# EAGLE design MiP_ProMini_16MHz-Pack (EAGLE 7.5.0)
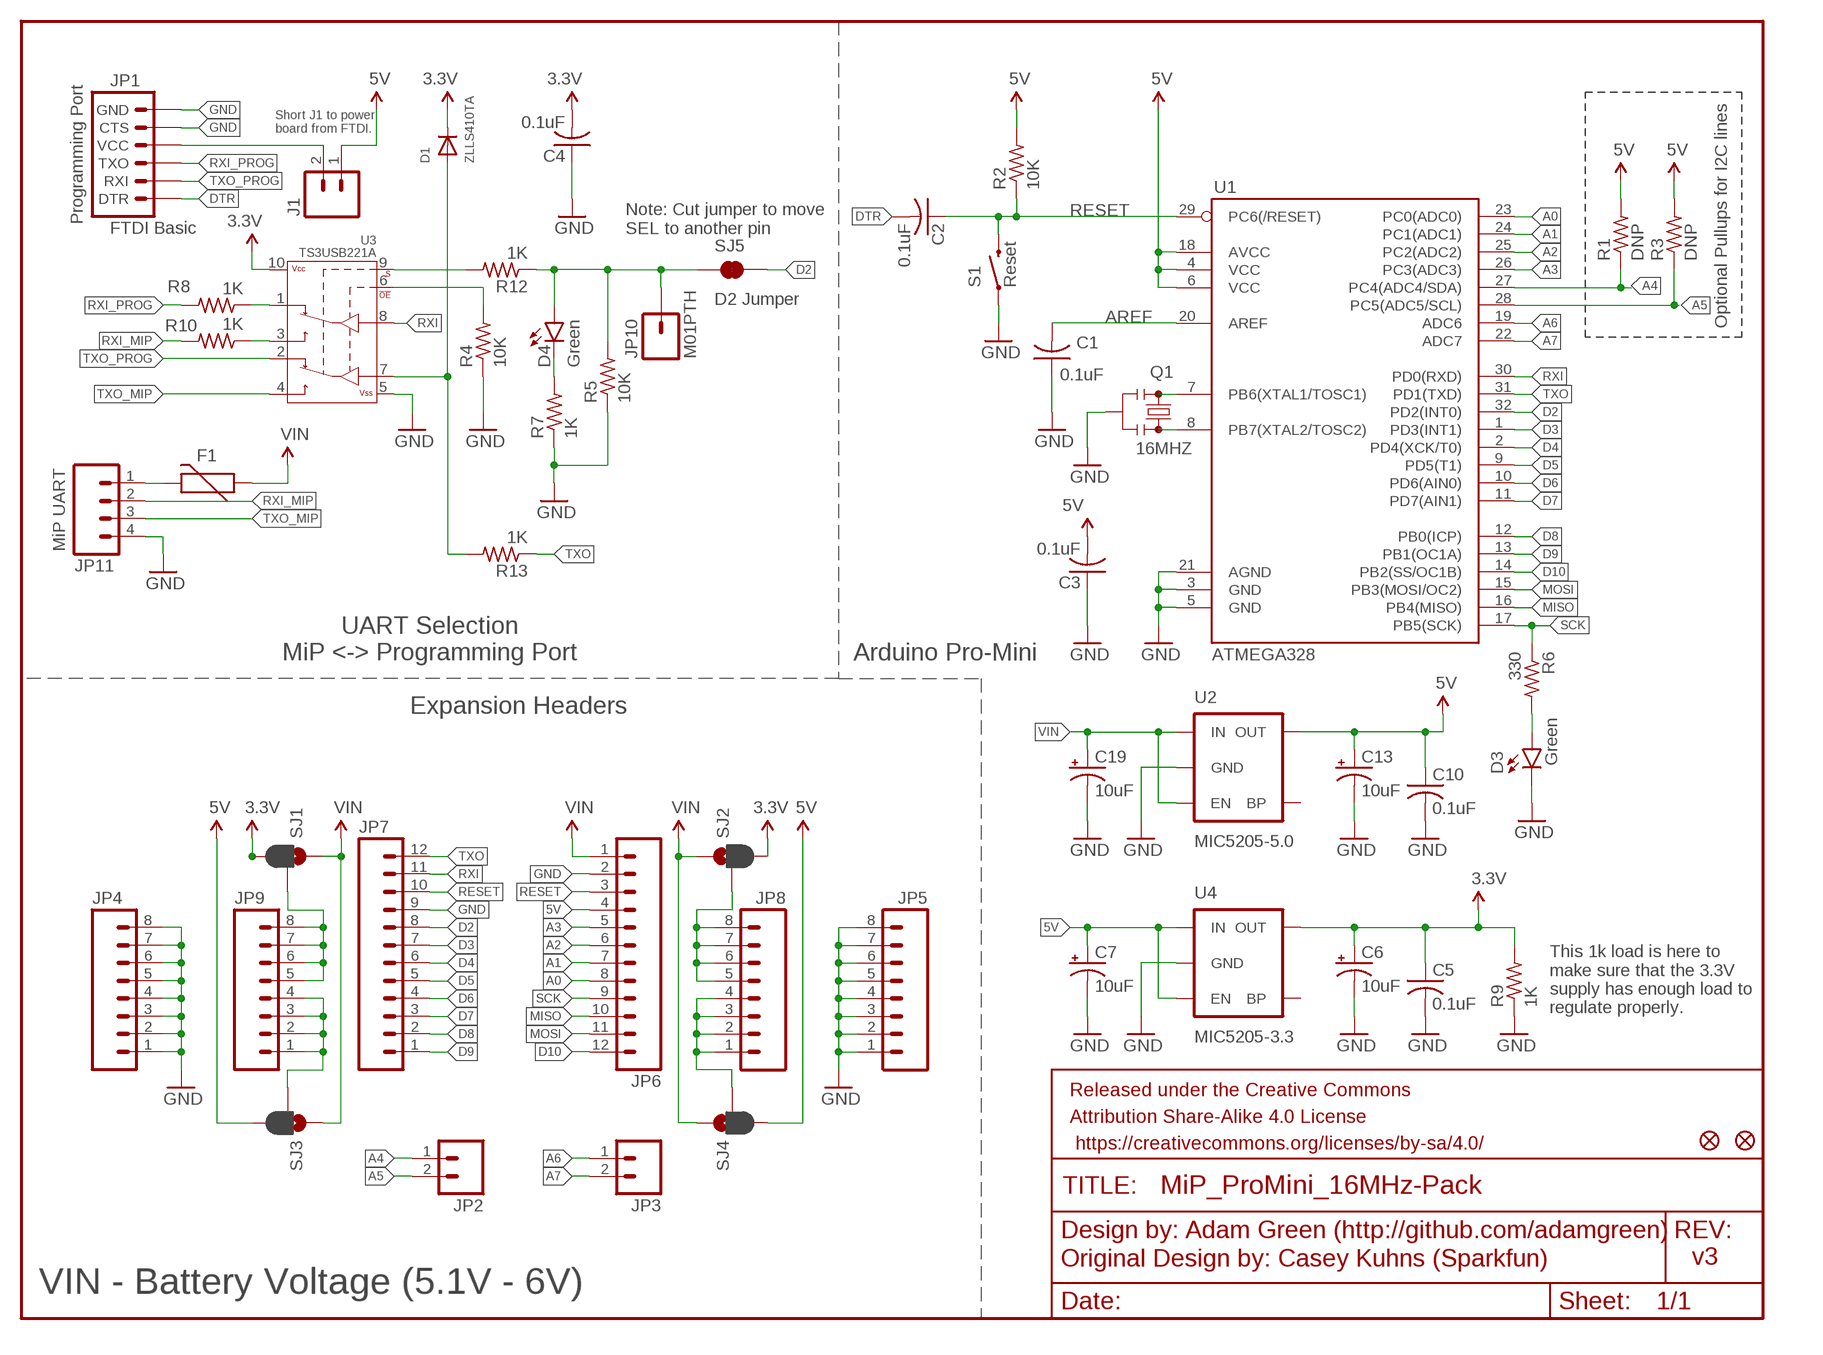
[diagram p0: schematic, sheet 1]

## Parts
C1  0.1uF  C-USC0805  [C0805]
C2  0.1uF  C-USC0805  [C0805]
C3  0.1uF  C-USC0805  [C0805]
C4  0.1uF  C-USC0805  [C0805]
C5  0.1uF  C-USC0805  [C0805]
C6  10uF  CAP_POL1206  [EIA3216]
C7  10uF  CAP_POL1206  [EIA3216]
C10  0.1uF  C-USC0805  [C0805]
C13  10uF  CAP_POL1206  [EIA3216]
C19  10uF  CAP_POL1206  [EIA3216]
D1  ZLLS410TA  DIODESOD-323F  [SOD-323F]
D3  Green  LED-GREEN0603  [LED-0603]
D4  Green  LED-GREEN0603  [LED-0603]
F1  PTCCUSTOM  [PTC-1206-CUSTOM]
FID1  FIDUCIAL1X2  [FIDUCIAL-1X2]
FID2  FIDUCIAL1X2  [FIDUCIAL-1X2]
FRAME1  FRAME-LETTER  [CREATIVE_COMMONS]
J1  M02PTH  [1X02]
JP1  FTDI Basic  ARDUINO_SERIAL_PROGRAMPTH  [1X06]
JP2  M02PTH  [1X02]
JP3  M02PTH  [1X02]
JP4  M081X08  [1X08]
JP5  M081X08  [1X08]
JP6  M12PTH  [1X12]
JP7  M12PTH  [1X12]
JP8  M081X08  [1X08]
JP9  M081X08  [1X08]
JP10  M01PTH  [1X01]
JP11  M04JST  [1X04-1.5MM_JST]
Q1  16MHZ  RESONATORMURATA_16MHZ  [RESONATOR-SMD-CUSTOM]
R1  DNP  R-US_R0805  [R0805]
R2  10K  R-US_R0805  [R0805]
R3  DNP  R-US_R0805  [R0805]
R4  10K  R-US_R0805  [R0805]
R5  10K  R-US_R0805  [R0805]
R6  330  R-US_R0805  [R0805]
R7  1K  R-US_R0805  [R0805]
R8  1K  R-US_R0805  [R0805]
R9  1K  R-US_R0805  [R0805]
R10  1K  R-US_R0805  [R0805]
R12  1K  R-US_R0805  [R0805]
R13  1K  R-US_R0805  [R0805]
S1  Reset  SWITCH-MOMENTARY-NOSMD  [TACTILE-SWITCH-SMD-CKN9112CT-ND]
SJ1  JUMPER-PAD-3-2OF3_NC_BY_PASTE  [PAD-JUMPER-3-2OF3_NC_BY_PASTE_YES_SILK_FULL_BOX]
SJ2  JUMPER-PAD-3-2OF3_NC_BY_PASTE  [PAD-JUMPER-3-2OF3_NC_BY_PASTE_YES_SILK_FULL_BOX]
SJ3  JUMPER-PAD-3-2OF3_NC_BY_PASTE  [PAD-JUMPER-3-2OF3_NC_BY_PASTE_YES_SILK_FULL_BOX]
SJ4  JUMPER-PAD-3-2OF3_NC_BY_PASTE  [PAD-JUMPER-3-2OF3_NC_BY_PASTE_YES_SILK_FULL_BOX]
SJ5  D2 Jumper  JUMPER-PAD-2-NC_BY_TRACE  [PAD-JUMPER-2-NC_BY_TRACE_YES_SILK]
U1  ATMEGA328  ATMEGA328_SMT  [TQFP32-08]
U2  MIC5205-5.0  MIC52053.3V  [SOT23-5]
U3  TS3USB221A  TS3USB221ACUSTOM  [QFN-10-RSE-CUSTOM]
U4  MIC5205-3.3  MIC52053.3V  [SOT23-5]

## Nets
3.3V: C4.2 C5.1 C6.A(+) D1.C R9.2 SJ1.3 SJ2.3 U3.10(VCC) U4.5(OUT)
5V: C3.2 C7.A(+) C10.1 C13.A(+) J1.1 JP6.4 R1.2 R2.2 R3.2 SJ3.3 SJ4.3 U1.4(VCC) U1.6(VCC) U1.18(AVCC) U2.5(OUT) U4.1(IN) U4.3(EN)
A0: JP6.8 U1.23(PC0(ADC0))
A1: JP6.7 U1.24(PC1(ADC1))
A2: JP6.6 U1.25(PC2(ADC2))
A3: JP6.5 U1.26(PC3(ADC3))
A4: JP2.1 R1.1 U1.27(PC4(ADC4/SDA))
A5: JP2.2 R3.1 U1.28(PC5(ADC5/SCL))
A6: JP3.1 U1.19(ADC6)
A7: JP3.2 U1.22(ADC7)
AREF: C1.2 U1.20(AREF)
D2: JP7.8 SJ5.2 U1.32(PD2(INT0))
D3: JP7.7 U1.1(PD3(INT1))
D4: JP7.6 U1.2(PD4(XCK/T0))
D5: JP7.5 U1.9(PD5(T1))
D6: JP7.4 U1.10(PD6(AIN0))
D7: JP7.3 U1.11(PD7(AIN1))
D8: JP7.2 U1.12(PB0(ICP))
D9: JP7.1 U1.13(PB1(OC1A))
D10: JP6.12 U1.14(PB2(SS/OC1B))
DTR: C2.2 JP1.1(DTR)
GND: C1.1 C3.1 C4.1 C5.2 C6.C(-) C7.C(-) C10.2 C13.C(-) C19.C(-) D3.C JP1.5(CTS) JP1.6(GND) JP4.1 JP4.2 JP4.3 JP4.4 JP4.5 JP4.6 JP4.7 JP4.8 JP5.1 JP5.2 JP5.3 JP5.4 JP5.5 JP5.6 JP5.7 JP5.8 JP6.2 JP7.9 JP11.4 Q1.2 R4.1 R5.1 R7.1 R9.1 S1.1 U1.3(GND) U1.5(GND) U1.21(AGND) U2.2(GND) U3.5(VSS) U4.2(GND)
MISO: JP6.10 U1.16(PB4(MISO))
MOSI: JP6.11 U1.15(PB3(MOSI/OC2))
N$1: Q1.3 U1.8(PB7(XTAL2/TOSC2))
N$2: JP9.5 JP9.6 JP9.7 JP9.8 SJ1.2
N$3: JP9.1 JP9.2 JP9.3 JP9.4 SJ3.2
N$4: Q1.1 U1.7(PB6(XTAL1/TOSC1))
N$5: JP8.5 JP8.6 JP8.7 JP8.8 SJ2.2
N$6: JP8.1 JP8.2 JP8.3 JP8.4 SJ4.2
N$7: D3.A R6.2
N$8: D4.C R7.2
N$9: R10.1 U3.3(2D+)
N$11: R8.1 U3.1(1D+)
N$12: R4.2 U3.6(!OE)
N$15: J1.2 JP1.4(VCC)
N$16: R12.2 U3.9(S)
N$17: F1.2 JP11.1
N$18: D1.A R13.2 U3.7(D-)
RESET: C2.1 JP6.3 JP7.10 R2.1 S1.3 U1.29(PC6(/RESET))
RXI: JP7.11 U1.30(PD0(RXD)) U3.8(D+)
RXI_MIP: JP11.2 R10.2
RXI_PROG: JP1.3(TXO) R8.2
SCK: JP6.9 R6.1 U1.17(PB5(SCK))
SELECT: D4.A JP10.1 R5.2 R12.1 SJ5.1
TXO: JP7.12 R13.1 U1.31(PD1(TXD))
TXO_MIP: JP11.3 U3.4(2D-)
TXO_PROG: JP1.2(RXI) U3.2(1D-)
VIN: C19.A(+) F1.1 JP6.1 SJ1.1 SJ2.1 SJ3.1 SJ4.1 U2.1(IN) U2.3(EN)
Unconnected: U2.4(BP) U4.4(BP)

## Notes on the sheet
- Short J1 to power
  board from FTDI.
- Programming Port
- Note: Cut jumper to move
  SEL to another pin
- Optional Pullups for I2C lines
- MiP UART
- UART Selection
  MiP <-> Programming Port
- Arduino Pro-Mini
- Expansion Headers
- This 1k load is here to 
  make sure that the 3.3V 
  supply has enough load to 
  regulate properly.
- Adam Green (http://github.com/adamgreen)
- Original Design by: Casey Kuhns (Sparkfun) | v3
- VIN - Battery Voltage (5.1V - 6V)

## Library data of the parts
C1-C5 C10 = rcl:C-US: CAPACITOR, American symbol
C6 C7 C13 C19 = SparkFun:CAP_POL: Capacitor Polarized These are standard SMD and PTH capacitors. Normally 10uF, 47uF, and 100uF in electrolytic and tantalum varieties. Always verify the external diameter of the through hole cap, it varies with capacity, voltage, and manufacturer. The EIA devices should be standard.
D1 = adafruit:DIODE: Diode SMADIODE - SMA Surface Mount Package 20V 1A Schottky Diode Digikey: 641-1014-6-ND DO-1N4148 - Through Hole Small Current Diode SOD-123 20V 1 A (.5mV Vf) Schottky Diode - Digikey: MBRX120TPMSCT-ND SOD-323 10V 570mA (.38mV Vf, 3ns) Schottky Diode - Digikey: ZLLS410CT-ND SOD-523 30V 30mA Schottky Diode (RB751S-40TE61) - Digikey: RB751S-40TE61CT-ND SOT23-R/W - SOT23 Package (R = Solder Paste/Reflow Ovens, W = Hand-Soldering) BAT54Film 40V 300mA - Digikey: 497-7162-1-ND
D3 D4 = SparkFun-LED:LED-GREEN: Various green LEDs Green LEDs used in SFE Production 0603- DIO-00821 LARGE- DIO-00862 LILYPAD- DIO-09910; PROD_ID: DIO-00821; VALUE: GREEN
F1 = adam_custom:PTC: Resettable Fuse PTC Resettable Fuse. Spark Fun Electronics SKU : COM-08357
FID1 FID2 = SparkFun-Aesthetics:FIDUCIAL: Fiducial Alignment Points Various fiducial points for machine vision alignment.
FRAME1 = SparkFun-Aesthetics:FRAME-LETTER: Schematic Frame Standard 8.5x11 US Letter frame
J1 = SparkFun-Connectors:M02: Standard 2-pin 0.1" header. Use with - straight break away headers ( PRT-00116) - right angle break away headers (PRT-00553) - swiss pins (PRT-00743) - machine pins (PRT-00117) - female headers (PRT-00115) Molex polarized connector foot print use with: PRT-08233 with associated crimp pins and housings. 2.54_SCREWTERM for use with PRT-10571. 3.5mm Screw Terminal footprints for PRT-08084 5mm Screw Terminal footprints for use with PRT-08432
JP1 = SparkFun:ARDUINO_SERIAL_PROGRAM
JP2 JP3 = SparkFun:M02: Header 2 Standard 2-pin 0.1" header. Use with straight break away headers (SKU : PRT-00116), right angle break away headers (PRT-00553), swiss pins (PRT-00743), machine pins (PRT-00117), and female headers (PRT-00115). Molex polarized connector foot print use with SKU : PRT-08233 with associated crimp pins and housings.
JP4 JP5 JP8 JP9 = SparkFun-Connectors:M08: Header 8 Standard 8-pin 0.1" header. Use with straight break away headers (SKU : PRT-00116), right angle break away headers (PRT-00553), swiss pins (PRT-00743), machine pins (PRT-00117), and female headers (PRT-00115).
JP6 JP7 = SparkFun:M12: Header 12 Standard 12-pin 0.1" header. Use with straight break away headers (SKU : PRT-00116), right angle break away headers (PRT-00553), swiss pins (PRT-00743), machine pins (PRT-00117), and female headers (PRT-00115).
JP10 = SparkFun-Connectors:M01: Header 1 Standard 1-pin 0.1" header. Use with straight break away headers (SKU : PRT-00116), right angle break away headers (PRT-00553), swiss pins (PRT-00743), machine pins (PRT-00117), and female headers (PRT-00115).
JP11 = SparkFun-Connectors:M04: Header 4 Standard 4-pin 0.1" header. Use with straight break away headers (SKU : PRT-00116), right angle break away headers (PRT-00553), swiss pins (PRT-00743), machine pins (PRT-00117), and female headers (PRT-00115). Molex polarized connector foot print use with SKU : PRT-08231 with associated crimp pins and housings. 1MM SMD Version SKU: PRT-10208
Q1 = adam_custom:RESONATOR: Resonator Small SMD resonator. Used, eg, on the Arduino Pro/ Pro Mini boards. 8MHz- XTAL-08895 16MHz- XTAL-08900
R1-R10 R12 R13 = rcl:R-US_: RESISTOR, American symbol
S1 = adam_custom:SWITCH-MOMENTARY-NO: Various NO switches- pushbuttons, reed, etc; PROD_ID: SWCH-08247
SJ1-SJ4 = SparkFun-Passives:JUMPER-PAD-3-2OF3_NC_BY_PASTE
SJ5 = SparkFun-Passives:JUMPER-PAD-2-NC_BY_TRACE
U1 = SparkFun-DigitalIC:ATMEGA328_SMT: 32-Pin Atmega328 part Commonly used on Arduino compatible boards Available in QFP and QFN packages TQFP is IC-09069 QFN is non-stock; PROD_ID: IC-09069; VALUE: ATMEGA328P
U2 U4 = SparkFun-PowerIC:MIC5205: MIC5205 150mA vreg 3.3V - VREG-00822 5V - VREG-00823; PROD_ID: VREG-00822
U3 = adam_custom:TS3USB221A: DPDT Analog Mux Vcc 2.5 to 3.3V Passes up to 5.5V at 3.3V supply 900MHz BW, 6Ω switch resistance

## Net classes
0 default: width 0.152 mm
1 vcc: width 0.254 mm

## Board
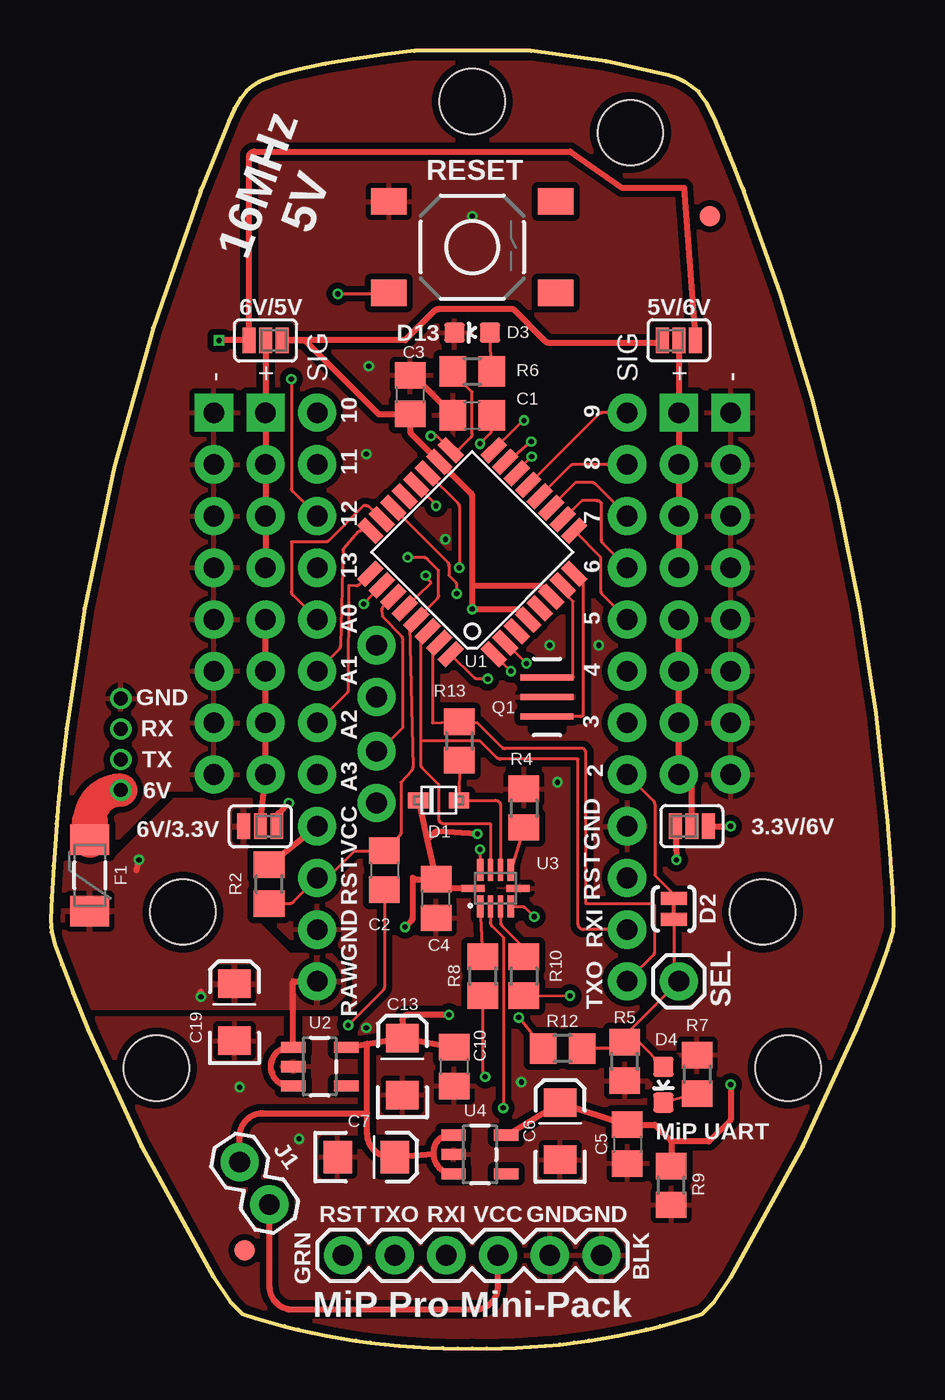
[diagram p1: board, top side]
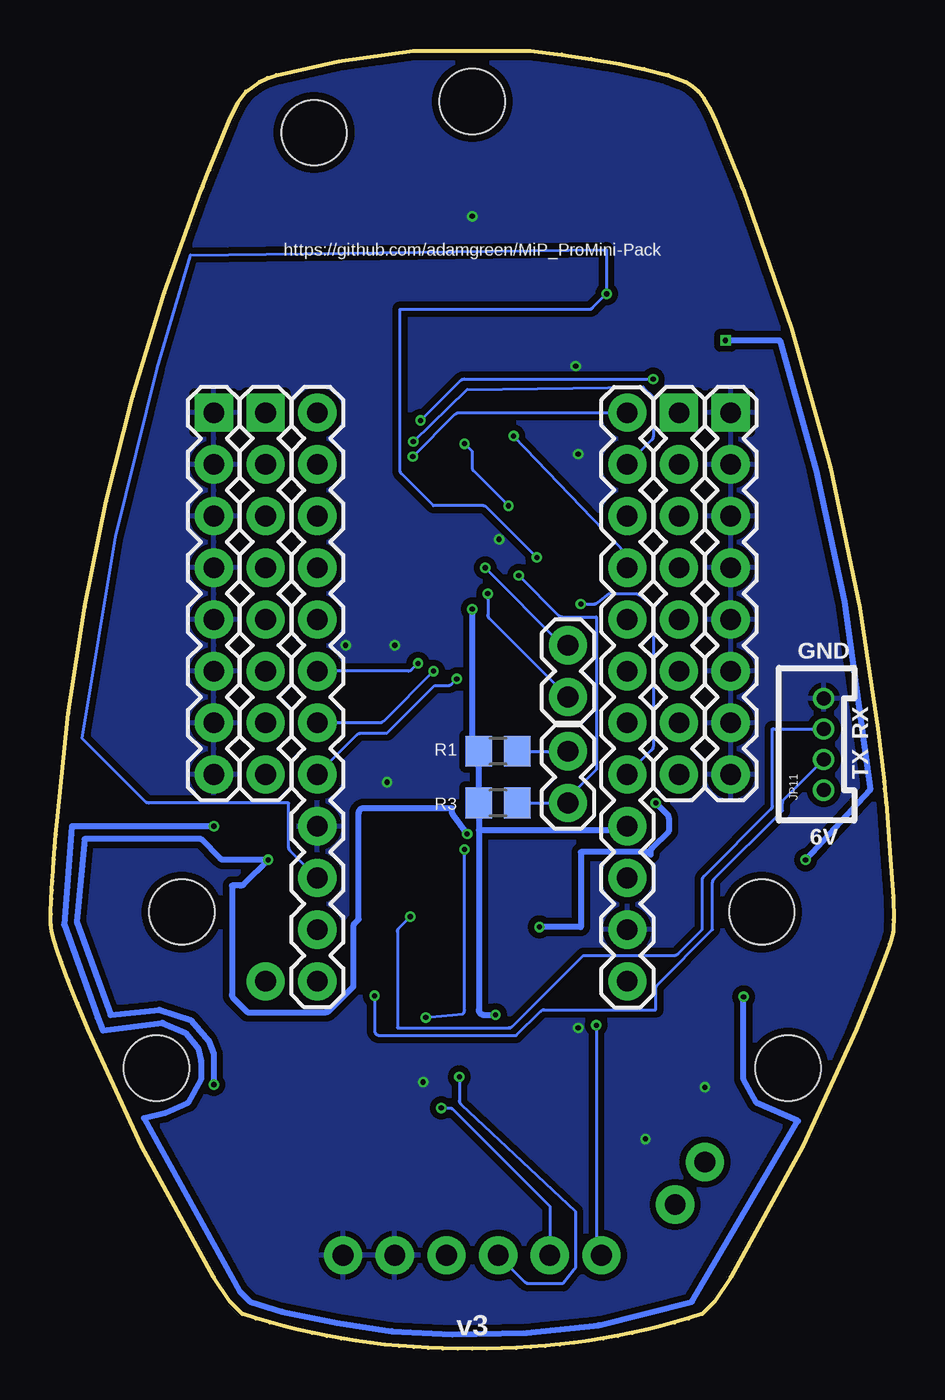
[diagram p2: board, bottom side, seen from below]

Size 41.42 x 63.77 mm. Coordinates in mm from the lower left corner, seen from the top.
Outline: 16.32,63.59 14.86,63.37 13.5,63.13 12.25,62.87 11.09,62.58 10.24,62.25 9.89,62.03 9.6,61.78 9.32,61.43 9.03,60.94 8.74,60.3 7.46,57.12 7.46,57.1 7.45,57.09 7.44,57.07 7.44,57.06 7.43,57.04 7.42,57.03 7.42,57.01 7.41,57 7.4,56.98 7.4,56.97 7.39,56.96 7.38,56.94 7.37,56.93 7.36,56.91 7.36,56.9 7.35,56.88 5.02,50.15 3.12,43.32 1.66,36.38 0.77,30.47 0.47,27.85 0.44,27.51 0.4,27.17 0.37,26.82 0.31,26.14 0.28,25.79 0.13,23.74 0.03,22.17 0,21.08 0.01,20.71 0.03,20.47 0.2,19.87 0.55,18.87 1.09,17.47 1.83,15.67 4.46,9.93 8.01,3.51 8.82,2.29 9.4,1.71 10.08,1.49 10.77,1.29 11.47,1.1 12.16,0.93 12.86,0.77 13.57,0.63 14.27,0.5 14.98,0.39 15.69,0.29 16.41,0.21 17.12,0.14 17.84,0.08 18.56,0.04 19.27,0.02 19.99,0 20.71,0.01 21.43,0 22.15,0.01 22.86,0.04 23.58,0.08 24.3,0.13 25.01,0.2 25.72,0.29 26.44,0.39 27.15,0.5 27.85,0.63 28.56,0.77 29.26,0.93 29.95,1.1 30.65,1.29 31.34,1.49 32.02,1.71 32.6,2.29 33.41,3.51 36.96,9.93 39.59,15.67 40.12,16.97 40.56,18.08 40.91,19 41.11,19.57 41.26,20.03 41.39,20.5 41.42,20.84 41.42,21.36 41.4,22.11 41.37,22.52 41.35,22.98 41.31,23.48 41.27,24.03 41.23,24.62 41.18,25.26 41.12,25.94 40.56,31.21 39.75,36.45 38.69,41.65 37.39,46.79 35.85,51.87 34.07,56.88 34.06,56.9 34.05,56.91 34.05,56.93 34.04,56.94 34.03,56.96 34.02,56.97 34.02,56.98 34.01,57 34,57.01 33.99,57.03 33.99,57.04 33.98,57.06 33.98,57.07 33.97,57.09 33.96,57.1 33.96,57.12 33.64,57.92 33.33,58.72 33.01,59.51 32.68,60.3 32.24,61.2 31.83,61.77 31.18,62.24 30.78,62.43 30.33,62.58 27.28,63.25 23.6,63.77 17.87,63.77 16.32,63.59
Copper layers (1*16): Top 0.035559375mm / dielectric 1.6mm / Bottom 0.035559375mm
Design rules "oshpark-2layer": minimum track width 6mil, minimum drill 10mil, track to track 6mil, track to pad 6mil, pad to pad 6mil, via to via 6mil, smd to smd 6mil, copper to edge 15mil, drill to drill 6mil, minimum pad ring 5mil, minimum via ring 5mil, stop-mask expansion 2.5mil, vias tented up to drill 0mil, thermal gap 10mil
Holes 3.2 mm at 20.71,61.28 28.48,59.76 34.98,21.45 5.19,13.78 36.23,13.78 6.49,21.45

### Footprints (pad centres in the part's own frame; a part is rotated, then mirrored left to right if it is on the bottom)
C0805 = smd 1.3 x 1.5: 1 -0.95,0; 2 0.95,0
EIA3216 = smd 1.4 x 1.6: A 1.4,0; C -1.4,0
SOD-323F = smd 1 x 0.8: A -1,0; C 1,0
LED-0603 = smd 1 x 1: A 0,-0.877; C 0,0.877
PTC-1206-CUSTOM = smd 1.5 x 1.9: 1 -1.75,0; 2 1.75,0
FIDUCIAL-1X2 = smd 1 x 1: 1 0,0
1X02 = drill 1.016 pad 1.88: 1 0,0; 2 2.54,0
1X06 = drill 1.016 pad 1.88: 1 0,0; 2 2.54,0; 3 5.08,0; 4 7.62,0; 5 10.16,0; 6 12.7,0
1X08 = drill 1.016 pad 1.88 square: 1 0,0 | drill 1.016 pad 1.88: 2 2.54,0; 3 5.08,0; 4 7.62,0; 5 10.16,0; 6 12.7,0; 7 15.24,0; 8 17.78,0
1X12 = drill 1.016 pad 1.88: 1 0,0; 2 2.54,0; 3 5.08,0; 4 7.62,0; 5 10.16,0; 6 12.7,0; 7 15.24,0; 8 17.78,0; 9 20.32,0; 10 22.86,0; 11 25.4,0; 12 27.94,0
1X01 = drill 1.016 pad 1.88: 1 0,0
1X04-1.5MM_JST = drill 0.7: 1 0,0; 2 1.5,0; 3 3,0; 4 4.5,0
RESONATOR-SMD-CUSTOM = smd 0.3 x 2.6: 1 -0.95,0; 2 0,0; 3 0.95,0
R0805 = smd 1.3 x 1.5: 1 -0.95,0; 2 0.95,0
TACTILE-SWITCH-SMD-CKN9112CT-ND = smd 1.75 x 1.3: 1 -4.1,2.25; 2 4.1,2.25; 3 -4.1,-2.25; 4 4.1,-2.25
PAD-JUMPER-3-2OF3_NC_BY_PASTE_YES_SILK_FULL_BOX = smd 0.635 x 1.27: 1 -0.813,0; 2 0,0; 3 0.813,0
PAD-JUMPER-2-NC_BY_TRACE_YES_SILK = smd 0.635 x 1.27: 1 -0.508,0; 2 0.508,0
TQFP32-08 = smd 1.27 x 0.559: 1 -4.293,2.8; 2 -4.293,2; 3 -4.293,1.2; 4 -4.293,0.4; 5 -4.293,-0.4; 6 -4.293,-1.2; 7 -4.293,-2; 8 -4.293,-2.8; 17 4.293,-2.8; 18 4.293,-2; 19 4.293,-1.2; 20 4.293,-0.4; 21 4.293,0.4; 22 4.293,1.2; 23 4.293,2; 24 4.293,2.8 | smd 0.559 x 1.27: 9 -2.8,-4.293; 10 -2,-4.293; 11 -1.2,-4.293; 12 -0.4,-4.293; 13 0.4,-4.293; 14 1.2,-4.293; 15 2,-4.293; 16 2.8,-4.293; 25 2.8,4.293; 26 2,4.293; 27 1.2,4.293; 28 0.4,4.293; 29 -0.4,4.293; 30 -1.2,4.293; 31 -2,4.293; 32 -2.8,4.293
SOT23-5 = smd 0.55 x 1.2: 1 -0.95,-1.3; 2 0,-1.3; 3 0.95,-1.3; 4 0.95,1.3; 5 -0.95,1.3
QFN-10-RSE-CUSTOM = smd 1.08 x 0.3: 1 -0.9,0.75; 4 -0.9,-0.75; 6 0.9,-0.75; 9 0.9,0.75 | smd 1.08 x 0.25: 2 -0.9,0.25; 3 -0.9,-0.25; 7 0.9,-0.25; 8 0.9,0.25 | smd 0.35 x 1.13: 5 0,-1.1; 10 0,1.1

### Placement (x,y rotation side)
C1  20.71,45.86 0 top
C2  16.39,23.51 270 top
C3  17.66,46.88 270 top
C4  18.93,22.11 90 top
C5  28.33,10.05 270 top
C6  25.03,10.68 90 top
C7  15.5,9.41 0 top
C10  19.82,13.86 270 top
C13  17.28,13.86 90 top
C19  9.02,16.53 90 top
D1  19.06,26.94 180 top
D3  20.71,49.93 90 top
D4  30.11,12.97 180 top
F1  1.91,23.26 90 top
FID1  9.53,4.84 0 top
FID2  32.39,55.64 0 top
FRAME1  4.43,-9.76 0 top  (outside the outline)
J1  9.28,9.16 305 top
JP1  14.36,4.59 0 top
JP2  16.01,29.35 270 bottom
JP3  16.01,34.56 270 bottom
JP4  33.41,45.99 270 bottom
JP5  8.01,45.99 270 bottom
JP6  13.09,18.05 90 bottom
JP7  28.33,45.99 270 bottom
JP8  30.87,45.99 270 bottom
JP9  10.55,45.99 270 bottom
JP10  30.87,18.05 0 top
JP11  3.44,27.45 90 bottom
Q1  24.39,32.02 270 top
R1  19.44,29.35 180 bottom
R2  10.73,22.83 90 top
R3  19.44,26.81 180 bottom
R4  23.25,26.56 270 top
R5  28.2,14.11 90 top
R6  20.71,48.02 0 top
R7  31.76,13.48 270 top
R8  21.22,18.3 270 top
R9  30.49,8.02 90 top
R10  23.25,18.3 270 top
R12  25.15,14.75 180 top
R13  20.07,29.86 270 top
S1  20.71,54.12 0 top
SJ1  10.29,25.67 0 top
SJ2  31.5,25.67 180 top
SJ3  10.55,49.55 0 top
SJ4  30.87,49.55 180 top
SJ5  30.62,21.61 90 top
U1  20.71,39.13 135 top
U2  13.22,13.86 270 top
U3  21.85,22.62 90 top
U4  21.09,9.54 270 top

### Tracks (layer width: path | path; a pad name or v marks a point on that pad's centre or on a via)
3.3V  (via drill 0.25 pad 0.51)
  Top 0.305: SJ2.3 v30.74,24.02 | v33.41,12.97 33.41,11.25 32.33,10.18 30.49,10.18 | U3.10 19.48,22.62 arc-45 19.3,22.7 C4.2 | D1.C 18.5,24.99 | 18.5,24.99 C4.2 | SJ1.3 11.11,26.12 arc-45 11.18,26.3 v11.69,26.81 | v17.41,20.72 17.71,21.02 arc45 17.79,21.2 17.79,23.13 arc45 17.95,23.06 C4.2 | v20.96,25.29 19.02,25.42 arc45 18.84,25.34 18.5,24.99 | U4.5 C6.A C5.1 29.67,11 30.49,10.18 | 30.49,10.18 R9.2
  Bottom 0.305: v33.41,12.97 33.41,14.49 33.66,15.13 34.55,16.14 36.08,16.65 38.49,16.4 40.14,20.97 39.76,25.04 34.04,25.04 33.1,24.09 arc-45 32.92,24.02 v30.74,24.02 31.94,22.82 arc45 32.12,22.75 32.52,22.75 32.52,17.39 arc-45 32.45,17.21 31.76,16.53 27.93,16.53 arc-45 27.75,16.6 26.55,17.8 26.55,20.74 arc45 26.48,20.92 26.3,21.1 26.3,26.3 arc90 26.04,26.56 21.73,26.56 21.73,26.41 arc-45 21.65,26.23 v20.96,25.29 | v11.69,26.81 11.13,26.25 arc45 11.06,26.07 11.06,25.42 11.87,24.6 arc-45 11.95,24.42 11.95,24.27 12,24.33 arc-45 12.18,24.4 15.37,24.4 15.37,20.72 v17.41,20.72
5V  (via drill 0.25 pad 0.51)
  Top 0.305: U2.5 15.55,14.98 | 15.55,14.98 C13.A | C13.A C10.1 | 15.55,11.57 15.55,10.56 arc90 16.69,9.41 C7.A 18.8,9.58 | 15.55,11.57 15.55,14.98 | U4.1 19.63,10.49 arc90 18.8,9.67 18.8,9.58 | 18.8,9.58 arc90 U4.3 | J1.1 9.28,10.43 arc-90 10.42,11.57 15.55,11.57 | v19.57,16.4 17.53,16.4 arc90 17.28,16.14 C13.A | R2.2 JP6.4 | U1.4 23.01,36.26 arc45 22.83,36.34 v20.71,36.34 20.71,37.48 | U1.6 24.13,37.41 arc45 23.95,37.48 20.71,37.48 | 20.71,37.48 20.71,41.86 arc45 20.64,42.04 U1.18 17.73,44.93 arc-45 17.66,45.11 C3.2 arc-45 17.62,45.91 16.11,45.91 12.55,49.47 arc45 12.37,49.55 SJ3.3 17.41,49.55 18.86,51 arc-45 19.04,51.07 22.74,51.07 24.32,49.49 arc45 24.5,49.42 30.11,49.42 arc-45 SJ4.3 SJ4.3 arc45 30.03,49.48
  Bottom 0.305: 20.39,25.47 R3.2 R1.2 20.46,29.35 arc90 20.71,29.61 v20.71,36.34 | 20.39,25.47 20.39,16.65 arc-90 20.14,16.4 v19.57,16.4 | JP6.4 arc90 13.29,25.47 20.39,25.47
A0
  Top 0.152: U1.23 15.67,41.34 arc45 15.49,41.42 15.37,41.42 13.67,39.71 arc-45 13.49,39.64 11.82,39.64 11.82,37.2 arc45 11.89,37.03 JP6.8
A1
  Top 0.152: U1.24 15.27,40.19 arc45 15.09,40.11 14.36,39.26 14.23,34.54 arc-45 14.16,34.36 JP6.7
A2
  Top 0.152: U1.25 15.17,37.55 arc-45 14.99,37.48 14.64,37.51 14.61,32.38 arc-45 14.54,32.2 JP6.6
A3  (via drill 0.25 pad 0.51)
  Top 0.152: U1.26 v15.37,36.59
  Bottom 0.152: v15.37,36.59 14.72,36.59 arc-45 14.54,36.67 13.98,37.1 12.69,37.1 arc45 12.51,37.03 11.82,36.47 11.82,29.59 arc45 11.89,29.41 JP6.5
A4
  Top 0.152: U1.27 16.34,36.46 arc45 16.26,36.28 16.29,35.98 17.23,35.02 arc-45 17.28,34.71 17.28,30.5 16.21,29.43 arc-45 16.03,29.35 JP2.1
  Bottom 0.152: R1.1 JP2.1
A5  (via drill 0.25 pad 0.51)
  Top 0.152: U1.28 18.68,37.61 v18.42,37.99
  Bottom 0.152: R3.1 JP2.2 16.01,26.96 arc45 15.94,27.14 14.61,28.46 14.61,35.96 16.29,35.96 arc45 16.46,36.03 v18.42,37.99
A6  (via drill 0.25 pad 0.51)
  Top 0.152: U1.19 20,41.54 arc-45 20.07,41.36 v20.07,38.37
  Bottom 0.152: v20.07,38.37 16.34,34.63 arc-45 16.16,34.56 JP3.1
A7  (via drill 0.25 pad 0.51)
  Top 0.152: U1.22 19.49,38.65 arc-45 19.57,38.47 19.57,37.99 19.87,37.68 arc-45 19.95,37.5 v19.95,37.1
  Bottom 0.152: v19.95,37.1 19.95,36.06 arc-45 19.87,35.88 JP3.2
AREF  (via drill 0.25 pad 0.51)
  Top 0.152: U1.20 18.89,41.52 arc-45 v18.93,41.42 | v21.09,44.47 21.59,44.96 arc45 21.66,45.14 C1.2
  Bottom 0.152: v18.93,41.42 20.64,43.12 arc45 20.71,43.3 20.71,44.09 v21.09,44.47
D2  (via drill 0.25 pad 0.51)
  Top 0.152: v21.47,32.91 20.97,32.91 arc-45 20.79,32.98 U1.32 | JP7.8 29.6,26.94 arc-45 29.68,26.76 29.68,23.26 30.54,22.39 arc-45 30.62,22.21 SJ5.2
  Bottom 0.152: JP7.8 26.37,30.17 arc45 26.19,30.24 24.9,30.24 22.56,32.58 21.91,32.58 arc-45 21.73,32.66 v21.47,32.91
D3  (via drill 0.25 pad 0.51)
  Top 0.152: U1.1 v22.61,33.29
  Bottom 0.152: v22.61,33.29 25.08,30.82 arc45 25.26,30.75 JP7.7
D4  (via drill 0.25 pad 0.51)
  Top 0.152: U1.2 arc-45 22.39,34.66 v23.38,33.67
  Bottom 0.152: v23.38,33.67 23.68,33.36 arc45 23.86,33.29 JP7.6
D5
  Top 0.152: JP7.5 27.11,37.05 arc-45 27.03,37.23 27.03,38.88 U1.9 | U1.9 arc-45 U1.9
D6
  Top 0.152: JP7.4 27.13,39.57 arc-45 27.06,39.74 27.06,41.55 27.01,41.6 arc45 26.83,41.67 26.09,41.67 25.19,40.77 arc-45 U1.10
D7
  Top 0.152: JP7.3 26.75,42.49 arc45 26.57,42.56 25.79,42.56 24.62,41.4 arc45 U1.11
D8
  Top 0.152: JP7.2 25.7,43.45 arc45 25.52,43.38 U1.12
D9
  Top 0.152: JP7.1 27.11,45.99 arc45 26.93,45.92 U1.13
D10  (via drill 0.25 pad 0.51)
  Top 0.152: U1.14 arc-45 22.95,43.15 v23.63,43.83
  Bottom 0.152: v23.63,43.83 21.55,45.92 arc45 21.37,45.99 JP6.12
DTR  (via drill 0.25 pad 0.51)
  Top 0.152: C2.2 16.39,17.77 arc-45 16.32,17.59 v14.61,15.89
  Bottom 0.152: v14.61,15.89 14.61,4.95 arc-45 14.54,4.77 JP1.1
GND  (via drill 0.25 pad 0.51)
  Top 0.305: C3.1 17.69,47.83 arc-45 17.87,47.76 C1.1
  other vias: 20.71,55.64 15.63,48.28 24.52,34.56 12.2,10.3 9.28,12.84 23.12,13.1 15.5,43.96 19.39,39.77 26.93,34.56 15.5,15.76 24.9,27.83
  pour Bottom (isolate 0.305): 41.41,63.77 41.41,-0.23 -0.59,-0.23 -0.59,63.77
  pour Top (isolate 0.305, rank 6): 41.41,63.77 41.41,-0.23 -0.59,-0.23 -0.59,63.77
MISO  (via drill 0.25 pad 0.51)
  Top 0.152: U1.16 23.21,45.59 arc-45 v23.25,45.61 | v11.82,47.64 11.82,42.29 arc45 11.89,42.11 JP6.10
  Bottom 0.152: v23.25,45.61 21.29,47.57 arc45 21.11,47.64 v11.82,47.64
MOSI  (via drill 0.25 pad 0.51)
  Top 0.152: U1.15 22.39,43.58 arc45 22.57,43.66 v23.61,44.57
  Bottom 0.152: v23.61,44.57 20.96,47.13 12.3,47.26 arc-45 12.29,47.22 11.82,46.75 11.82,44.83 arc45 11.89,44.65 JP6.11
N$1
  Top 0.152: U1.8 26.1,37.7 arc-45 26.17,37.53 26.17,31.13 arc-45 26.02,31.07 Q1.3
N$2
  Top 0.305: SJ1.2 JP9.8 JP9.7 JP9.6 JP9.5
N$3
  Top 0.305: SJ3.2 JP9.1 JP9.2 JP9.3 JP9.4
N$4
  Top 0.152: 25.66,32.97 25.66,33.04 | 25.66,33.04 25.66,36.72 25.23,37.15 arc-45 25.16,37.33 U1.7 | Q1.1 24.39,33.04 25.66,33.04
N$5
  Top 0.305: SJ2.2 31.5,27.47 arc45 31.43,27.65 JP8.8 JP8.7 JP8.6 JP8.5
N$6
  Top 0.305: SJ4.2 JP8.1 JP8.2 JP8.3 JP8.4
N$7
  Top 0.152: R6.2 D3.A
N$8
  Top 0.152: R7.2 D4.C
N$9
  Top 0.152: U3.3 22.1,20.95 arc45 22.18,20.77 23.18,19.78 arc-45 23.25,19.6 R10.1
N$11
  Top 0.152: U3.1 R8.1
N$12
  Top 0.152: R4.2 U3.6
N$15
  Top 0.305: J1.2 10.74,3.06 arc90 11.88,1.92 20.84,1.92 arc90 21.98,3.06 JP1.4
N$16  (via drill 0.25 pad 0.51)
  Top 0.152: R12.2 v23,16.27 | v21.09,24.53 arc-45 21.1,24.5 U3.9
  Bottom 0.152: v23,16.27 21.16,16.45 arc-45 21.09,16.63 v21.09,24.53
N$17
  Top 1.626: JP11.1 arc90 1.91,25.92
  Top 1.778: 1.91,25.92 F1.2
N$18
  Top 0.152: R13.2 D1.A 21.85,26.94 arc-90 22.1,26.69 U3.7
RESET  (via drill 0.25 pad 0.51)
  Top 0.152: R2.1 11.73,21.88 arc45 11.91,21.95 JP6.3 13.49,23.13 arc45 13.67,23.2 14.92,24.45 16.37,24.45 arc45 C2.1 17.08,25.15 arc45 17.2,25.35 17.2,27.83 17.71,28.39 arc45 17.79,28.57 17.64,35.57 arc-45 17.86,35.72 U1.29 18.98,36.84 arc45 19.06,37.02 19.06,38.24 18.5,38.8 arc45 18.32,38.88 v17.53,38.88 | v14.1,51.83 16.52,51.83 arc45 S1.3
  Bottom 0.152: v17.53,38.88 20,41.34 arc-45 20.18,41.42 22.61,41.42 24.19,42.99 arc45 24.27,43.17 24.27,51.07 14.97,51.07 arc-45 14.79,51.14 v14.1,51.83 14.1,53.99 34.55,53.74 36.2,48.15 38.23,39.89 39.89,29.99 36.78,26.89 arc-45 36.61,26.81 29.73,26.81 29.73,24.63 arc-45 29.65,24.45 JP7.10
RXI
  Top 0.152: U1.30 18.37,35.1 arc45 18.17,34.92 18.17,29.86 | 18.17,29.86 18.17,28.72 arc45 18.24,28.54 19.06,27.73 19.06,26.05 arc90 19.31,25.8 21.6,25.8 U3.8 arc90 U3.8 | JP7.11 26.17,20.59 arc-90 25.92,20.84 25.92,28.97 22.08,28.97 arc-45 21.91,29.05 21.09,29.86 18.17,29.86
RXI_MIP  (via drill 0.25 pad 0.51)
  Top 0.152: R10.2 v25.51,17.34
  Bottom 0.152: v25.51,17.34 25.51,15.64 arc-90 25.26,15.38 18.55,15.38 17.35,16.58 arc45 17.18,16.65 11.69,16.65 11.69,17.69 arc45 11.62,17.87 8.9,20.59 8.9,22.9 arc45 8.82,23.08 5.47,26.43 5.47,26.81 arc45 5.4,26.99 JP11.2
RXI_PROG  (via drill 0.25 pad 0.51)
  Top 0.152: R8.2 21.22,13.58 arc45 21.29,13.4 v21.34,13.35
  Bottom 0.152: v21.34,13.35 21.34,12.19 arc-45 21.27,12.01 15.63,6.75 15.63,4.06 arc45 15.7,3.88 16.26,3.19 17.94,3.19 arc45 18.12,3.27 JP1.3
SCK  (via drill 0.25 pad 0.51)
  Top 0.152: R6.1 arc45 19.81,47.91 20.71,47.01 20.71,44.95 arc-45 20.64,44.77 20.08,44.22 arc-45 19.9,44.15 U1.17 18.97,44.83 arc45 v18.68,44.85
  Bottom 0.152: v18.68,44.85 13.16,39.08 arc45 13.09,38.9 JP6.9
SELECT
  Top 0.152: SJ5.1 30.62,18.41 arc45 30.69,18.23 JP10.1 28.28,15.46 arc45 28.2,15.28 R5.2 | D4.A 28.96,14.99 arc45 28.79,15.06 R5.2 | R5.2 27.96,14.82 arc-45 27.78,14.75 R12.1
TXO
  Top 0.152: U1.31 18.83,34.42 arc45 18.75,34.24 18.75,30.75 R13.1 arc45 20.22,30.75 20.96,30.75 22.16,29.55 arc45 22.34,29.48 26.17,29.48 26.22,29.43 arc-45 26.3,29.25 26.3,21.86 29.49,21.86 arc-45 29.67,21.79 29.68,21.78 29.68,19.5 arc-45 29.6,19.32 JP7.12
TXO_MIP  (via drill 0.25 pad 0.51)
  Top 0.152: U3.4 23.16,21.72 arc-45 23.33,21.65 v23.76,21.23
  Bottom 0.152: v23.76,21.23 24.32,20.66 arc-45 24.39,20.48 24.39,15.76 18.91,15.76 arc-45 18.73,15.84 15.25,19.32 10.78,19.32 arc-45 10.6,19.39 9.41,20.59 9.41,23.03 arc45 9.33,23.2 6.03,26.51 arc-45 5.95,26.69 5.95,30.47 arc-45 5.9,30.45 JP11.3
TXO_PROG  (via drill 0.25 pad 0.51)
  Top 0.152: U3.2 21.6,20.95 arc45 21.68,20.77 22.23,20.21 v22.23,11.83
  Bottom 0.152: v22.23,11.83 21.83,11.83 arc45 21.65,11.75 16.9,7 JP1.2
VIN  (via drill 0.25 pad 0.51)
  Top 0.305: U2.3 11.75,12.91 arc-90 10.8,13.86 arc-90 11.75,14.81 U2.1 11.92,18.05 JP6.1 | v8.26,49.55 SJ3.1 9.74,58.56 arc-90 9.99,58.82 25.54,58.82 28.08,57.04 31.12,57.04 SJ4.1 | v4.33,24.02 4.2,23.51 | SJ2.1 v33.41,25.67 | v7.37,17.29 7.37,17.54
  Bottom 0.305: v8.26,49.55 5.6,49.55 3.82,43.2 2.42,36.72 1.15,27.45 v4.33,24.02 | v33.41,25.67 40.39,25.67 40.77,20.84 39.12,16.27 38.87,15.64 35.95,16.02 34.81,15.51 34.17,14.75 34.04,14.11 34.04,13.22 34.68,12.08 35.82,11.57 36.84,11.32 32.14,2.81 31.63,2.3 30.06,1.82 27.36,1.26 24.67,0.85 21.7,0.7 18.04,0.78 14.49,1.16 9.91,2.3 4.71,11.19 6.74,12.08 7.37,13.22 v7.37,17.29
  pour Top (isolate 0.305): 0.52,23.89 3.06,23.89 6.1,26.94 9.79,26.94 9.79,21.23 11.69,19.32 13.72,19.32 14.36,18.68 14.36,17.41 13.72,16.78 0.52,16.78

### Text on the board
tPlace: RESET | 16MHz / 5V | 6V/5V | 5V/6V | D13 | - | + | SIG | SIG | + | - | 10 | 9 | 11 | 8 | 12 | 7 | 13 | 6 | A0 | 5 | A1 | 4 | GND | A2 | RX | 3 | TX | A3 | 2 | 6V | VCC | GND | 6V/3.3V | 3.3V/6V | RST | RST | GND | RXI | D2 | RAW | TXO | SEL | MiP UART | RST | TXO | RXI | VCC | GND | GND | GRN | BLK | MiP Pro Mini-Pack
bPlace: https://github.com/adamgreen/MiP_ProMini-Pack | GND | RX | TX | 6V | v3
tDocu: Adam Green